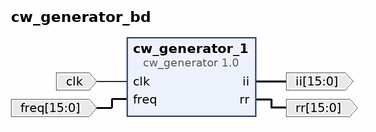
[diagram p0: block diagram of the top level]
# Vivado block design cw_generator_bd, xc7k160tfbg484-2, Vivado 2021.2
create_bd_design cw_generator_bd

create_bd_port -dir I -type clk clk
create_bd_port -dir I -from 15 -to 0 -type data freq
create_bd_port -dir O -from 15 -to 0 -type data ii
create_bd_port -dir O -from 15 -to 0 -type data rr

create_bd_cell -type ip -vlnv User_Company:SysGen:cw_generator:1.0 cw_generator_1

# ---- connections ----

connect_bd_net [get_bd_ports clk] [get_bd_pins cw_generator_1/clk]
connect_bd_net [get_bd_pins cw_generator_1/ii] [get_bd_ports ii]
connect_bd_net [get_bd_pins cw_generator_1/rr] [get_bd_ports rr]
connect_bd_net [get_bd_ports freq] [get_bd_pins cw_generator_1/freq]

validate_bd_design
save_bd_design
